# EAGLE design Main (EAGLE 9.0.0)
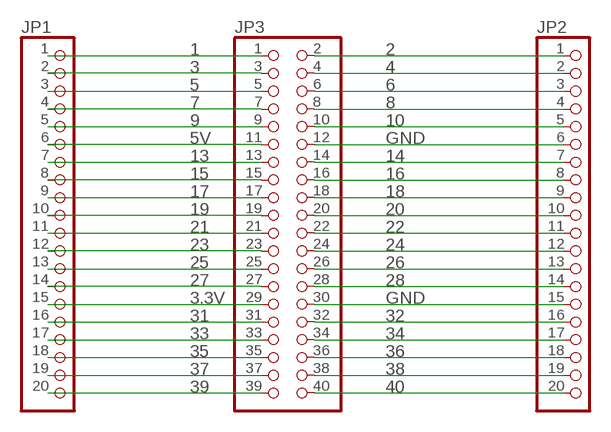
[diagram p0: schematic, sheet 1]

## Parts
JP1  PINHD-1X20  [1X20]
JP2  PINHD-1X20  [1X20]
JP3  PINHD-2X20  [2X20]

## Nets
1: JP1.1 JP3.1
2: JP2.1 JP3.2
3: JP1.2 JP3.3
3.3V: JP1.15 JP3.29
4: JP2.2 JP3.4
5: JP1.3 JP3.5
5V: JP1.6 JP3.11
6: JP2.3 JP3.6
7: JP1.4 JP3.7
8: JP2.4 JP3.8
9: JP1.5 JP3.9
10: JP2.5 JP3.10
13: JP1.7 JP3.13
14: JP2.7 JP3.14
15: JP1.8 JP3.15
16: JP2.8 JP3.16
17: JP1.9 JP3.17
18: JP2.9 JP3.18
19: JP1.10 JP3.19
20: JP2.10 JP3.20
21: JP1.11 JP3.21
22: JP2.11 JP3.22
23: JP1.12 JP3.23
24: JP2.12 JP3.24
25: JP1.13 JP3.25
26: JP2.13 JP3.26
27: JP1.14 JP3.27
28: JP2.14 JP3.28
31: JP1.16 JP3.31
32: JP2.16 JP3.32
33: JP1.17 JP3.33
34: JP2.17 JP3.34
35: JP1.18 JP3.35
36: JP2.18 JP3.36
37: JP1.19 JP3.37
38: JP2.19 JP3.38
39: JP1.20 JP3.39
40: JP2.20 JP3.40
GND: JP2.6 JP2.15 JP3.12 JP3.30

## Library data of the parts
JP1 JP2 = pinhead:PINHD-1X20: PIN HEADER
JP3 = pinhead:PINHD-2X20: PIN HEADER

## Net classes
0 default: width 1.016 mm

## Board
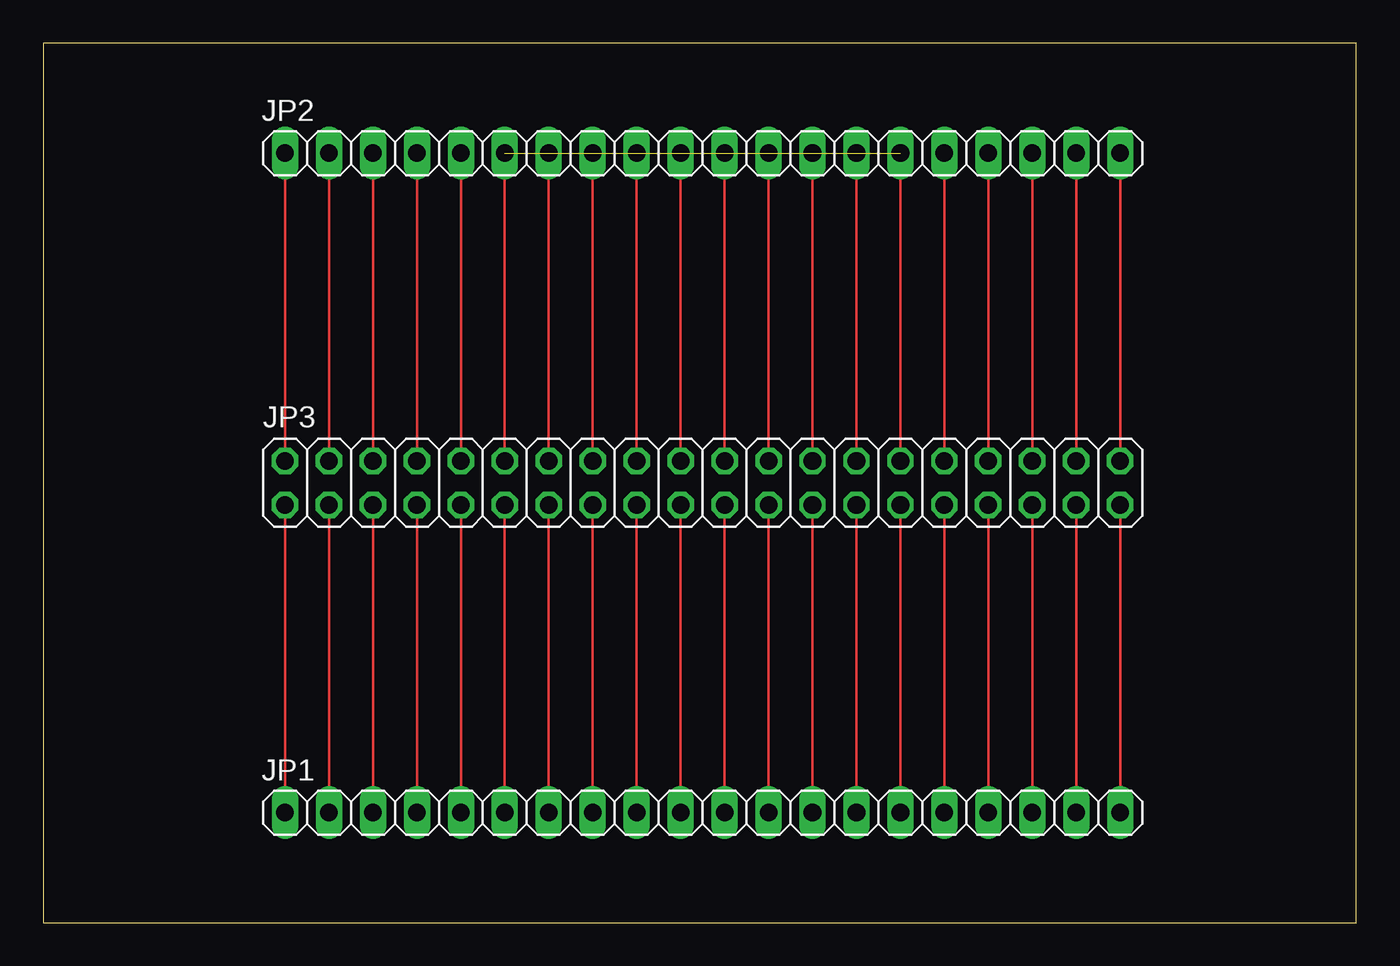
[diagram p1: board, top side]

Size 75.87 x 50.79 mm. Coordinates in mm from the lower left corner, seen from the top.
Outline: 0,0 75.87,0 75.87,50.79 0,50.79 0,0
Copper layers (1*16): Top 0.035mm / dielectric 1.5mm / Bottom 0.035mm
Design rules "default *": minimum track width 1000mil, minimum drill 0.35mm, track to track 6mil, track to pad 6mil, pad to pad 6mil, via to via 6mil, smd to smd 6mil, copper to edge 40mil, drill to drill 6mil, minimum pad ring 10mil, minimum via ring 8mil, stop-mask expansion 4mil, vias tented up to drill 0mil, thermal gap 10mil

### Footprints (pad centres in the part's own frame; a part is rotated, then mirrored left to right if it is on the bottom)
1X20 = drill 1.016 long: 1 -24.13,0; 2 -21.59,0; 3 -19.05,0; 4 -16.51,0; 5 -13.97,0; 6 -11.43,0; 7 -8.89,0; 8 -6.35,0; 9 -3.81,0; 10 -1.27,0; 11 1.27,0; 12 3.81,0; 13 6.35,0; 14 8.89,0; 15 11.43,0; 16 13.97,0; 17 16.51,0; 18 19.05,0; 19 21.59,0; 20 24.13,0
2X20 = drill 1.016 octagon: 1 -24.13,-1.27; 2 -24.13,1.27; 3 -21.59,-1.27; 4 -21.59,1.27; 5 -19.05,-1.27; 6 -19.05,1.27; 7 -16.51,-1.27; 8 -16.51,1.27; 9 -13.97,-1.27; 10 -13.97,1.27; 11 -11.43,-1.27; 12 -11.43,1.27; 13 -8.89,-1.27; 14 -8.89,1.27; 15 -6.35,-1.27; 16 -6.35,1.27; 17 -3.81,-1.27; 18 -3.81,1.27; 19 -1.27,-1.27; 20 -1.27,1.27; 21 1.27,-1.27; 22 1.27,1.27; 23 3.81,-1.27; 24 3.81,1.27; 25 6.35,-1.27; 26 6.35,1.27; 27 8.89,-1.27; 28 8.89,1.27; 29 11.43,-1.27; 30 11.43,1.27; 31 13.97,-1.27; 32 13.97,1.27; 33 16.51,-1.27; 34 16.51,1.27; 35 19.05,-1.27; 36 19.05,1.27; 37 21.59,-1.27; 38 21.59,1.27; 39 24.13,-1.27; 40 24.13,1.27

### Placement (x,y rotation side)
JP1  38.1,6.35 0 top
JP2  38.1,44.45 0 top
JP3  38.1,25.4 0 top

### Tracks (layer width: path | path; a pad name or v marks a point on that pad's centre or on a via)
1
  Top 0.152: JP1.1 JP3.1
2
  Top 0.152: JP2.1 JP3.2
3
  Top 0.152: JP3.3 JP1.2
3.3V
  Top 0.152: JP3.29 JP1.15
4
  Top 0.152: JP2.2 JP3.4
5
  Top 0.152: JP3.5 JP1.3
5V
  Top 0.152: JP3.11 JP1.6
6
  Top 0.152: JP2.3 JP3.6
7
  Top 0.152: JP3.7 JP1.4
8
  Top 0.152: JP2.4 JP3.8
9
  Top 0.152: JP3.9 JP1.5
10
  Top 0.152: JP2.5 JP3.10
13
  Top 0.152: JP1.7 JP3.13
14
  Top 0.152: JP2.7 JP3.14
15
  Top 0.152: JP3.15 JP1.8
16
  Top 0.152: JP2.8 JP3.16
17
  Top 0.152: JP3.17 JP1.9
18
  Top 0.152: JP2.9 JP3.18
19
  Top 0.152: JP3.19 JP1.10
20
  Top 0.152: JP2.10 JP3.20
21
  Top 0.152: JP3.21 JP1.11
22
  Top 0.152: JP2.11 JP3.22
23
  Top 0.152: JP3.23 JP1.12
24
  Top 0.152: JP2.12 JP3.24
25
  Top 0.152: JP3.25 JP1.13
26
  Top 0.152: JP2.13 JP3.26
27
  Top 0.152: JP3.27 JP1.14
28
  Top 0.152: JP2.14 JP3.28
31
  Top 0.152: JP3.31 JP1.16
32
  Top 0.152: JP3.32 JP2.16
33
  Top 0.152: JP3.33 JP1.17
34
  Top 0.152: JP3.34 JP2.17
35
  Top 0.152: JP3.35 JP1.18
36
  Top 0.152: JP3.36 JP2.18
37
  Top 0.152: JP3.37 JP1.19
38
  Top 0.152: JP3.38 JP2.19
39
  Top 0.152: JP3.39 JP1.20
40
  Top 0.152: JP3.40 JP2.20
GND  (1 unrouted)
  Top 0.152: JP2.6 JP3.12 | JP2.15 JP3.30